# Altium schematic sheet IsoDcDc-BSR033A.SchDoc: LM5180EVM-S05 Buck Converter Schematic
size 431 x 279 mm; Date: Not shown in title block; ApprovedBy: Not shown in title block; CheckedBy: Not shown in title block; Author: Not shown in title block; CompanyName: Not shown in title block; DrawnBy: K Nielson; Engineer: Not shown in title block; Organization: Not shown in title block; Address1: Not shown in title block; Address2: Not shown in title block; Address3: Not shown in title block; Address4: Not shown in title block; DocumentNumber: 1; Revision: Use project parameter SCH_Rev; SheetNumber: 1; SheetTotal: 2; PageSetup: Record=PageOptions|CenterHorizontal=True|CenterVertical=True|PrintScale=1.00|XCorrection=1.00|YCorrection=1.00|PrintKind=0|BorderSize=5000000|LeftOffset=0|BottomOffset=0|Orientation=2|PaperLength=1000|PaperWidth=1000|Scale=100|PaperSource=15|PrintQuality=600|MediaType=1|DitherType=10|PaperKind=Letter|PrintScaleMode=1; CurrentTime: Not shown in title block; CurrentDate: Not shown in title block; Time: Not shown in title block; DocumentFullPathAndName: Not shown in title block; DocumentName: Not shown in title block; ModifiedDate: Not shown in title block; ImagePath: Not shown in title block
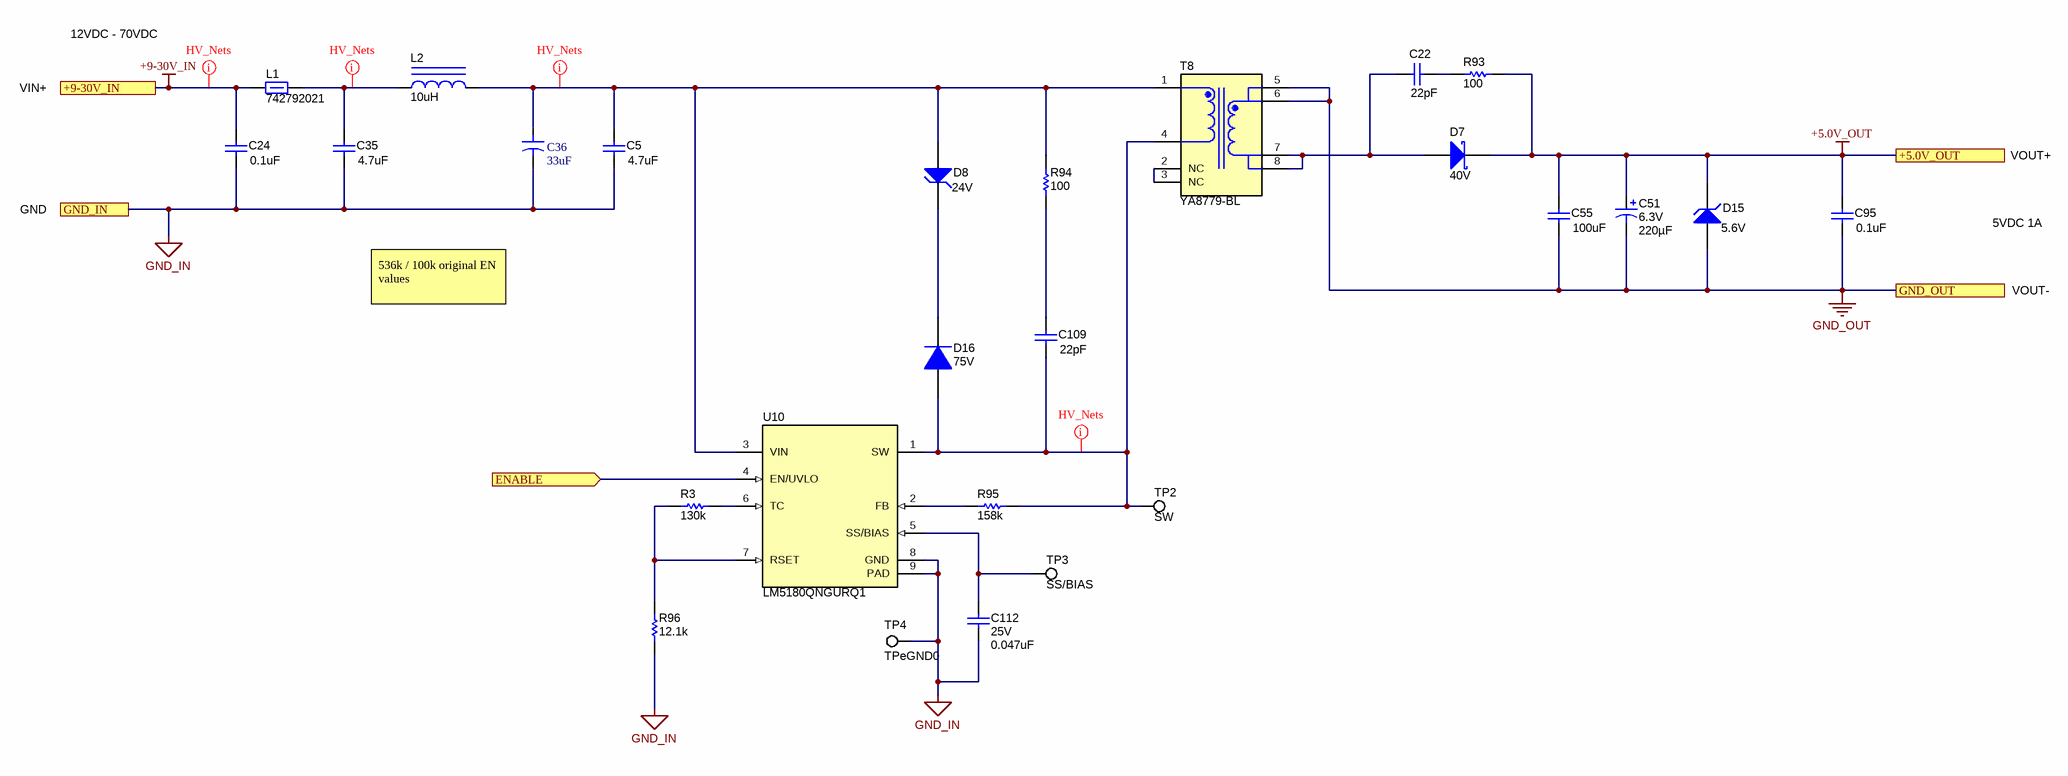
[diagram p0: IsoDcDc-BSR033A.SchDoc]

## Parts
C5  ValueDisplayed: 4.7uF  [1210C]  (hidden comment: GRM32DC72A475KE01L)
C22  ValueDisplayed: 22pF  [0603C]  (hidden comment: GRM1885C2A220JA01D)
C24  ValueDisplayed: 0.1uF  [0603C]  (hidden comment: GRM188R72A104KA35J)
C35  ValueDisplayed: 4.7uF  [1210C]  (hidden comment: GRM32DC72A475KE01L)
C36  value 33uF  [CAPC7343X430M]  (hidden comment: CAP TANTALUM 33UF 50V 2917)
C51  VDC_V: 6.3V  ValueDisplayed: 220µF  [7343-31]  (hidden comment: T598D107M010ATE025)
C55  ValueDisplayed: 100uF  [1210C]  (hidden comment: GRM32EC80J107ME20L)
C95  ValueDisplayed: 0.1uF  [0603C]  (hidden comment: GRM188R72A104KA35J)
C109  ValueDisplayed: 22pF  [0603C]  (hidden comment: GRM1885C2A220JA01D)
C112  VDC_V: 25V  ValueDisplayed: 0.047uF  [0603C]  (hidden comment: GCM188R71E473KA37D)
D7  40V  [SMAF]
D8  Vz_V: 24V  [PowerDI123]  (hidden comment: DFLZ24-7)
D15  Vz_V: 5.6V  [SOD-323]  (hidden comment: MMSZ5232BS-7-F)
D16  75V  [SOD-323]
L1  742792021  [0805_HV]
L2  ValueDisplayed: 10uH  [WE-TPC-M1]  (hidden comment: 744042100)
R3  ValueDisplayed: 130k  [0603R]  (hidden comment: CRCW0603130KFKEA)
R93  ValueDisplayed: 100  [0603R]  (hidden comment: CRCW0603100RFKEA)
R94  ValueDisplayed: 100  [0603R]  (hidden comment: CRCW0603100RFKEA)
R95  ValueDisplayed: 158k  [0603R]  (hidden comment: CRCW0603158KFKEA)
R96  ValueDisplayed: 12.1k  [0603R]  (hidden comment: CRCW060312K1FKEA)
T8  YA8779-BL  [Coilcraft_YA8779-CL]
TP2  SW  [Testpoint_Keystone_Miniature]
TP3  SS/BIAS  [Testpoint_Keystone_Miniature]
TP4  TPeGND0  [Testpoint_Keystone_Miniature]
U10  LM5180QNGURQ1  [NGU0008C]

## Ports
+5.0V_OUT, +9-30V_IN, ENABLE (in), GND_IN, GND_OUT

## Nets
+5.0V_OUT: C51.1(+) C55.1 C95.1 D7.1(K) D15.1(K) R93.1 ; port +5.0V_OUT
+9-30V_IN: C24.1 L1.1 ; port +9-30V_IN
GND_IN: C5.1 C24.2 C35.1 C36.2 C112.2 R96.1 TP4.1 U10.8(GND) U10.9(PAD) ; port GND_IN
GND_OUT: C51.2(-) C55.2 C95.2 D15.2(A) T8.5 T8.6 ; port GND_OUT
ENABLE: U10.4(EN/UVLO) ; port ENABLE
NetC5_2: C5.2 C36.1 D8.2(A) L2.2 R94.2 T8.1 U10.3(VIN)
NetC22_1: C22.1 R93.2
NetC22_2: C22.2 D7.2(A) T8.7 T8.8
NetC35_2: C35.2 L1.2 L2.1
NetC109_1: C109.1 R94.1
NetC109_2: C109.2 D16.2(A) R95.2 T8.4 TP2.1 U10.1(SW)
NetC112_1: C112.1 TP3.1 U10.5(SS/BIAS)
NetD8_1: D8.1(K) D16.1(K)
NetR3_1: R3.1 R96.2 U10.7(RSET)
NetR3_2: R3.2 U10.6(TC)
NetR95_1: R95.1 U10.2(FB)
NetT8_2: T8.2(NC) T8.3(NC)

## Layout directives
net class HV_Nets: +9-30V_IN, NetC5_2, NetC35_2, NetC109_2

## Notes on the sheet
- 12VDC - 70VDC
- VIN+
- GND
- VOUT+
- 5VDC 1A
- 536k / 100k original EN values
- VOUT-
- Drawn By:
- SVN Rev:
- Number:
- TID #:
- Orderable:
- Rev:
- Sheet Title:
- File:
- Project Title:
- Designed for:
- Assembly Variant:
- Mod. Date:
- Sheet:
- Size:
- of
- B
- http://www.ti.com
- Texas Instruments and/or its licensors do not warrant the accuracy or completeness of this specification or any information contained therein. Texas Instruments and/or its licensors do not warrant that this design will meet the specifications, will be suitable for your application or fit for any particular purpose, or will operate in an implementation. Texas Instruments and/or its licensors do not warrant that the design is production worthy. You should completely validate and test your design implementation to confirm the system functionality for your application.
- Engineer:
- Contact:
- © Texas Instruments

## Library data of the parts
C5 C35 = CMP-0009182-2: CAP, CERM, 4.7 uF, 100 V, +/- 10%, X7S, 1210; Manufacturer: MuRata; TaMin_C: -55°C; Polarized: N; SizeAreaWB_mm2: 14.7; Value1: Unknown; U/M: EA; Value: 4.7uF; TaMax_C: 125°C; SizeZ_mm: 2.2; SizeX_mm: 3.2; SizeY_mm: 2.5; Cap_Case: 1210; Value2: 100V; SizeArea_mm2: 8; CompType: Capacitor; Cap_F: 4.7µF; AEC Category: Q200; Publisher: Texas Instruments; TempCo: X7S; Published: 2008-06-19; RoHS: Y; MountType: SMT; Supplier 1: Mouser; PackageReference: 1210; Tolerance_%: 10%; LatestRevisionDate: 2017-03-09; PartNumber: GRM32DC72A475KE01L; AEC Qualified: N; VDC_V: 100V; ComponentLink1Description: Datasheet link; AEC Grade: N/A; Supplier Part Number 1: 81-GRM32DC72A475KE1L; Technology: Ceramic; ComponentLink1URL: http://search.murata.co.jp/Ceramy/image/img/A01X/G101/ENG/GRM32DC72A475KE01-01.pdf
C22 = CMP-0007255-4: CAP, CERM, 22 pF, 100 V, +/- 5%, C0G/NP0, 0603; Manufacturer: MuRata; TaMin_C: -55°C; Polarized: N; SizeAreaWB_mm2: 4.68; U/M: EA; Value: 22pF; TaMax_C: 125°C; SizeZ_mm: 1; SizeX_mm: 1.6; SizeY_mm: 0.8; Cap_Case: 0603; Value2: 100V; SizeArea_mm2: 1.28; CompType: Capacitor; AEC Category: Q200; Value1: Unknown; ComponentLink1URL: http://search.murata.co.jp/Ceramy/PnsearchViewAction.do?HnOFG=ON&HnNFG=ON&SEL_CNT=50&sLang=en&sKey=GRM1885C2A220JA01D&x=9&y=9&search=startwith; Supplier Part Number 2: 81-GRM1885C2A220JA01; Supplier 2: Mouser; TempCo: C0G/NP0; RoHS: Y; MountType: SMT; Supplier 1: Digi-Key; PackageReference: 0603; Tolerance_%: 5%; PartNumber: GRM1885C2A220JA01D; AEC Qualified: ?; Cap_F: 22pF; VDC_V: 100V; ComponentLink1Description: Datasheet link; Supplier Part Number 1: 490-1335-1-ND; Technology: Ceramic; Publisher: Texas Instruments; Published: 2008-06-19; LatestRevisionDate: 2017-03-09
C24 C95 = CMP-0007470-5: CAP, CERM, 0.1 uF, 100 V, +/- 10%, X7R, 0603; Manufacturer: MuRata; TaMin_C: -55°C; Polarized: N; SizeAreaWB_mm2: 4.68; Value1: Unknown; U/M: EA; Value: 0.1uF; TaMax_C: 125°C; SizeZ_mm: 1; SizeX_mm: 1.6; SizeY_mm: 0.8; Cap_Case: 0603; Value2: 100V; SizeArea_mm2: 1.28; CompType: Capacitor; Cap_F: 100nF; AEC Category: Q200; Supplier Part Number 2: 81-GRM188R72A104KA5J; Publisher: Texas Instruments; Supplier 2: Mouser; TempCo: X7R; Published: 2008-06-19; RoHS: Y; MountType: SMT; Supplier 1: Digi-Key; PackageReference: 0603; Tolerance_%: 10%; LatestRevisionDate: 2017-03-09; PartNumber: GRM188R72A104KA35J; AEC Qualified: ?; VDC_V: 100V; ComponentLink1Description: Datasheet link; Supplier Part Number 1: 490-6439-1-ND; Technology: Ceramic; ComponentLink1URL: http://search.murata.co.jp/Ceramy/image/img/A01X/G101/ENG/GRM188R72A104KA35-01.pdf
C36 = T521X336M050ATE075: 33µF Molded Tantalum Polymer Capacitor 50V 2917 (7343 Metric) 75mOhm @ 100kHz; Supplier 1: Digi-Key; Supplier Part Number 1: 399-11721-1-ND
C51 = CMP-0074683-2: CAP, Aluminum Polymer, 220 µF, 6.3 V,+/- 20%, 0.01 ohm, 7343-31 SMD; Manufacturer: MuRata; PartNumber: ECASD60J227M010K00; TaMin_C: -40°C; ESR_ohm: 0.01; Polarized: Y; SizeAreaWB_mm2: 58.59; Value: 220uF; TaMax_C: 105°C; SizeZ_mm: 3.1; SizeX_mm: 7.3; SizeY_mm: 4.3; SizeArea_mm2: 31.39; CompType: Capacitor; AEC Qualified: N; IRMS_A: 3A; AEC Category: Q200; ComponentLink1URL: http://www.murata.com/~/media/webrenewal/support/library/catalog/products/capacitor/polymer/c90e.ashx; Supplier Part Number 2: 11AC3033; Supplier 2: Newark; Supplier Part Number 3: 81-ECASD60J227M010K0; Supplier 3: Mouser; RoHS: Y; Value1: 0.01 ohm; MountType: SMT; Supplier 1: Digi-Key; PackageReference: 7343-31; Tolerance_%: 20%; Cap_Case: 7343-31; Value2: 6.3V; Series: ECAS; Cap_F: 220µF; ComponentLink1Description: Datasheet link; AEC Grade: N/A; Supplier Part Number 1: 490-12529-1-ND; Technology: Aluminum Polymer
C55 = CMP-0009199-2: CAP, CERM, 100 uF, 6.3 V, +/- 20%, X6S, 1210; Manufacturer: MuRata; TaMin_C: -55°C; Polarized: N; SizeAreaWB_mm2: 14.7; Value1: Unknown; U/M: EA; Value: 100uF; TaMax_C: 105°C; SizeZ_mm: 2.7; SizeX_mm: 3.2; SizeY_mm: 2.5; Cap_Case: 1210; Value2: 6.3V; SizeArea_mm2: 8; Cap_F: 100µF; AEC Category: Q200; Supplier Part Number 2: 81-GRM32EC80J107ME0L; Publisher: Texas Instruments; Supplier 2: Mouser; Supplier Part Number 3: 1889302; TempCo: X6S; Supplier 3: Farnell; Published: 2008-06-19; RoHS: Y; MountType: SMT; Supplier 1: Digi-Key; PackageReference: 1210; Tolerance_%: 20%; CompType: Capacitor; LatestRevisionDate: 2017-03-09; PartNumber: GRM32EC80J107ME20L; AEC Qualified: ?; VDC_V: 6.3V; ComponentLink1Description: Datasheet link; Supplier Part Number 1: GRM32EC80J107ME20L-ND; Technology: Ceramic; ComponentLink1URL: http://search.murata.co.jp/Ceramy/PnsearchViewAction.do?HnOFG=ON&HnNFG=ON&SEL_CNT=50&sLang=en&sKey=GRM32EC80J107ME20L&x=9&y=9&search=startwith
C109 = CMP-0007255-4: CAP, CERM, 22 pF, 100 V, +/- 5%, C0G/NP0, 0603; Manufacturer: MuRata; TaMin_C: -55°C; Polarized: N; SizeAreaWB_mm2: 4.68; Value1: Unknown; U/M: EA; Value: 22pF; TaMax_C: 125°C; SizeZ_mm: 1; SizeX_mm: 1.6; SizeY_mm: 0.8; Cap_Case: 0603; Value2: 100V; SizeArea_mm2: 1.28; CompType: Capacitor; AEC Category: Q200; Supplier Part Number 2: 81-GRM1885C2A220JA01; Supplier 2: Mouser; TempCo: C0G/NP0; RoHS: Y; MountType: SMT; Supplier 1: Digi-Key; PackageReference: 0603; Tolerance_%: 5%; PartNumber: GRM1885C2A220JA01D; AEC Qualified: ?; Cap_F: 22pF; VDC_V: 100V; ComponentLink1Description: Datasheet link; Supplier Part Number 1: 490-1335-1-ND; Technology: Ceramic; ComponentLink1URL: http://search.murata.co.jp/Ceramy/PnsearchViewAction.do?HnOFG=ON&HnNFG=ON&SEL_CNT=50&sLang=en&sKey=GRM1885C2A220JA01D&x=9&y=9&search=startwith; Publisher: Texas Instruments; Published: 2008-06-19; LatestRevisionDate: 2017-03-09
C112 = CMP-0007141-5: CAP, CERM, 0.047 uF, 25 V, +/- 10%, X7R, AEC-Q200 Grade 1, 0603; Manufacturer: MuRata; TaMin_C: -55°C; Polarized: N; SizeAreaWB_mm2: 4.68; Value1: Unknown; U/M: EA; TaMax_C: 125°C; SizeZ_mm: 1; SizeX_mm: 1.6; SizeY_mm: 0.8; Cap_Case: 0603; SizeArea_mm2: 1.28; CompType: Capacitor; AEC Qualified: Y; Cap_F: 47nF; AEC Category: Q200; Supplier Part Number 2: 81-GCM188R71E473KA7D; Publisher: Texas Instruments; Supplier 2: Mouser; TempCo: X7R; Published: 2008-06-19; RoHS: Y; MountType: SMT; Value: 0.047uF; Supplier 1: Digi-Key; PackageReference: 0603; Tolerance_%: 10%; Value2: 25V; LatestRevisionDate: 2017-03-09; PartNumber: GCM188R71E473KA37D; ComponentLink1Description: Datasheet link; Supplier Part Number 1: 490-8018-1-ND; Technology: Ceramic; ComponentLink1URL: http://psearch.murata.com/capacitor/product/GCM188R71E473KA37%23.pdf; AEC Grade: 1
D7 = CMP-0028855-1: Diode, Schottky, 40 V, 3 A, AEC-Q101, SMAF; PartNumber: FSV340AF; Manufacturer: Fairchild Semiconductor; SizeAreaWB_mm2: 19.95; SizeArea_mm2: 11.75; AEC Qualified: Y; TJmax_C: 150°C; AEC Category: Q101; SizeZ_mm: 1; Green_REACh: Incomplete; Io_A: 3A; Vf_V: 5dV; SizeY_mm: 2.5; Value2: 0.5V; Green_Lifecycle: Not Set; U/M: EA; SizeX_mm: 4.7; ComponentLink1Description: Datasheet link; RoHS: Y; Supplier 1: Digi-Key; Vr_V: 40V; Green_EU RoHS: Incomplete; PackageReference: SMAF; Value: 40V; Publisher: Texas Instruments; Supplier Part Number 2: 512-FSV340AF; Supplier 2: Mouser; Published: 2008-06-26; LatestRevisionDate: 2017-05-08; ComponentLink1URL: https://www.fairchildsemi.com/datasheets/FS/FSV330AF.pdf; Value1: 3A; CompType: Diode; MountType: SMT; Supplier Part Number 1: FSV340AFCT-ND; Type: Schottky; Green_EU RoHS-2: Incomplete
D8 = CMP-0005415-2: Diode, Zener, 24 V, 1 W, PowerDI123; Manufacturer: Diodes Inc.; Power_W: 1W; SizeAreaWB_mm2: 13.066; RJA_CperW: 110; U/M: EA; Value: 24V; SizeZ_mm: 0.98; SizeX_mm: 3.7; SizeY_mm: 1.78; SizeArea_mm2: 6.586; AEC Category: Q101; Supplier Part Number 2: 621-DFLZ24-7; Publisher: Texas Instruments; Supplier 2: Mouser; Supplier Part Number 3: 2077975; Supplier 3: Farnell; Published: 2008-10-08; RoHS: Y; Value1: 1W; MountType: SMT; Supplier 1: Digi-Key; LatestRevisionNote: Updated Supplier Data; PackageReference: PowerDI123; CompType: Zener; LatestRevisionDate: 2017-03-09; PartNumber: DFLZ24-7; AEC Qualified: ?; ComponentLink1Description: Datasheet link; Supplier Part Number 1: DFLZ24DICT-ND; ComponentLink1URL: http://www.diodes.com/datasheets/ds30464.pdf
D15 = CMP-0005855-1: Diode, Zener, 5.6 V, 200 mW, SOD-323; Manufacturer: Diodes Inc.; Power_W: 200mW; SizeAreaWB_mm2: 8.695; Value1: 0.2W; RJA_CperW: 350; U/M: EA; Value: 5.6V; SizeZ_mm: 1; SizeX_mm: 2.7; SizeY_mm: 1.35; SizeArea_mm2: 3.645; AEC Category: Q101; ComponentLink1URL: http://www.diodes.com/datasheets/ds31038.pdf; Supplier Part Number 2: 621-MMSZ5232BS-F; Publisher: Texas Instruments; Supplier 2: Mouser; Published: 2008-10-08; RoHS: Y; MountType: SMT; Supplier 1: Digi-Key; LatestRevisionNote: Updated Supplier Data; PackageReference: SOD-323; CompType: Zener; LatestRevisionDate: 2017-03-09; PartNumber: MMSZ5232BS-7-F; AEC Qualified: ?; ComponentLink1Description: Datasheet link; Supplier Part Number 1: MMSZ5232BS-FDICT-ND
D16 = CMP-0029019-1: Diode, Ultrafast, 75 V, 0.25 A, SOD-323; Manufacturer: Central Semiconductor; PartNumber: CMDD4448; Io_A: 2.5dA; Green_Lifecycle: Not Set; SizeAreaWB_mm2: 8.695; Green_REACh: Incomplete; Value1: 0.25A; TJmax_C: 175°C; U/M: EA; SizeZ_mm: 1; SizeX_mm: 2.7; SizeY_mm: 1.35; Vf_V: 1.2V; SizeArea_mm2: 3.645; AEC Category: Q101; ComponentLink1URL: http://www.centralsemi.com/PDFs/products/CMDD4448.PDF; Publisher: Texas Instruments; Vr_V: 75V; Published: 2008-06-26; RoHS: Y; MountType: SMT; Green_EU RoHS-2: Incomplete; Value: 75V; Green_EU RoHS: Incomplete; PackageReference: SOD-323; Value2: 1.2V; CompType: Diode; Type: Ultrafast; LatestRevisionDate: 2017-05-08; AEC Qualified: ?; ComponentLink1Description: Datasheet link
L1 = CMP-0003072-1: Ferrite Bead, 22 ohm @ 100 MHz, 6 A, 0805; Manufacturer: Wurth Elektronik; Ztyp@1GHz_Ohm: 40.219; ZTyp@100MHz_Ohm: 22; SizeAreaWB_mm2: 6.75; DCR_ohm: 8m; Value1: 0.008 ohm; Value: 22 ohm; Imax_A: 6A; SizeZ_mm: 1.45; SizeX_mm: 2; SizeY_mm: 1.25; SizeArea_mm2: 2.5; ComponentLink1URL: http://katalog.we-online.de/pbs/datasheet/742792021.pdf; Supplier Part Number 2: 710-742792021; Publisher: Texas Instruments; Supplier 2: Mouser; Published: 2014-04-30; RoHS: Y; MountType: SMT; Supplier 1: Digi-Key; PackageReference: 0805; Value2: 6A; CompType: Ferrite Bead; LatestRevisionDate: 2017-03-09; PartNumber: 742792021; ComponentLink1Description: Datasheet link; Supplier Part Number 1: 732-4637-1-ND; ValueDisplayed: 22 ohm
L2 = CMP-0063804-1: Inductor, Shielded Drum Core, Ferrite, 10 uH, 1 A, 0.12 ohm, SMD; Manufacturer: Wurth Elektronik; Isat: 1A @ 35% inductance drop; Irms: 1.3A @ 30C rise; Green_Lifecycle: Active; SizeAreaWB_mm2: 33.64; DCR_ohm: 1.2d; Green_REACh: Passed; Value: 10uH; Imax_A: 1A; SizeZ_mm: 1.8; SizeX_mm: 4.8; SizeArea_mm2: 23.04; Ind_H: 10µH; AEC Category: Q200; PackageReference: WE-TPC-M1; ComponentLink1Description: Datasheet link; ComponentLink1URL: http://www.we-online.com/eisos/pdf/744042100.pdf; Supplier Part Number 2: 710-744042100; Publisher: Texas Instruments; Supplier 2: Mouser; Supplier Part Number 3: 1635842; Supplier 3: Farnell; Published: 2008-06-26; RoHS: Y; Value1: 0.12 ohm; Material: Ferrite; MountType: SMT; Green_EU RoHS-2: Incomplete; Supplier 1: Digi-Key; Green_EU RoHS: Passed; SizeY_mm: 4.8; Value2: 1A; CompType: Inductor; LatestRevisionDate: 2017-06-02; PartNumber: 744042100; AEC Qualified: ?; Supplier Part Number 1: 732-1025-1-ND; Technology: Shielded Drum Core
R3 = CMP-0022036-4: RES, 130 k, 1%, 0.1 W, AEC-Q200 Grade 0, 0603; Manufacturer: Vishay-Dale; Power_W: 100mW; TempCo: 100 ppm/C; Value: 130k; EIA_Code: E96; SizeX_mm: 1.6; SizeY_mm: 0.8; SizeZ_mm: 1; Value2: 0.1W; SizeArea_mm2: 1.28; CompType: Resistor; AEC Qualified: Y; VDC_V: 75V; AEC Category: Q200; AEC Grade: 0; Supplier Part Number 2: 52K8127; Supplier 2: Newark; Supplier Part Number 3: 71-CRCW0603-130K-E3; Supplier 3: Mouser; Value_Code: 130k; RoHS: E; Value1: 1%; MountType: SMT; Supplier 1: Digi-Key; PackageReference: 0603; Tolerance_%: 1%; Res_ohm: 130k; PartNumber: CRCW0603130KFKEA; ComponentLink1Description: Datasheet link; Supplier Part Number 1: 541-130KHCT-ND; Technology: Thick Film; ComponentLink1URL: http://www.vishay.com/docs/20035/dcrcwe3.pdf
R93 R94 = CMP-0021991-3: RES, 100, 1%, 0.1 W, 0603; Manufacturer: Vishay-Dale; Power_W: 100mW; TempCo: 100 ppm/C; Value_Code: 100R; U/M: EA; Value: 100; EIA_Code: E96; SizeX_mm: 1.6; SizeY_mm: 0.8; SizeZ_mm: 1; Value2: 0.1W; SizeArea_mm2: 1.28; CompType: Resistor; VDC_V: 75V; AEC Category: Q200; Supplier Part Number 2: 52K8078; Publisher: Texas Instruments; Supplier 2: Newark; Supplier Part Number 3: 71-CRCW0603-100-E3; Supplier 3: Mouser; Published: 2008-06-26; RoHS: Y; Value1: 1%; MountType: SMT; Supplier 1: Digi-Key; PackageReference: 0603; Tolerance_%: 1%; Res_ohm: 100; LatestRevisionDate: 2017-03-09; PartNumber: CRCW0603100RFKEA; AEC Qualified: ?; ComponentLink1Description: Datasheet link; Supplier Part Number 1: 541-100HCT-ND; Technology: Thick Film; ComponentLink1URL: http://www.vishay.com/docs/20035/dcrcwe3.pdf
R95 = CMP-0022064-4: RES, 158 k, 1%, 0.1 W, AEC-Q200 Grade 0, 0603; Manufacturer: Vishay-Dale; Power_W: 100mW; TempCo: 100 ppm/C; Value: 158k; EIA_Code: E96; SizeX_mm: 1.6; SizeY_mm: 0.8; SizeZ_mm: 1; Value2: 0.1W; SizeArea_mm2: 1.28; CompType: Resistor; AEC Qualified: Y; VDC_V: 75V; AEC Category: Q200; AEC Grade: 0; ComponentLink1URL: http://www.vishay.com/docs/20035/dcrcwe3.pdf; Supplier Part Number 2: 52K8164; Supplier 2: Newark; Supplier Part Number 3: 71-CRCW0603-158K-E3; Supplier 3: Mouser; Value_Code: 158k; RoHS: E; Value1: 1%; MountType: SMT; Supplier 1: Digi-Key; PackageReference: 0603; Tolerance_%: 1%; Res_ohm: 158k; PartNumber: CRCW0603158KFKEA; ComponentLink1Description: Datasheet link; Supplier Part Number 1: 541-158KHCT-ND; Technology: Thick Film
R96 = CMP-0022030-3: RES, 12.1 k, 1%, 0.1 W, 0603; Manufacturer: Vishay-Dale; Power_W: 100mW; TempCo: 100 ppm/C; Value_Code: 12k1; U/M: EA; Value: 12.1k; EIA_Code: E96; SizeX_mm: 1.6; SizeY_mm: 0.8; SizeZ_mm: 1; Value2: 0.1W; SizeArea_mm2: 1.28; CompType: Resistor; VDC_V: 75V; AEC Category: Q200; Supplier Part Number 2: 52K8105; Publisher: Texas Instruments; Supplier 2: Newark; Supplier Part Number 3: 71-CRCW0603-12.1K-E3; Supplier 3: Mouser; Published: 2008-06-26; RoHS: Y; Value1: 1%; MountType: SMT; Supplier 1: Digi-Key; PackageReference: 0603; Tolerance_%: 1%; LatestRevisionDate: 2017-03-09; PartNumber: CRCW060312K1FKEA; AEC Qualified: ?; ComponentLink1Description: Datasheet link; Supplier Part Number 1: 541-12.1KHCT-ND; Technology: Thick Film; Res_ohm: 12.1k; ComponentLink1URL: http://www.vishay.com/docs/20035/dcrcwe3.pdf
T8 = CMP-0085524-1: Transformer, 30 uH, SMD; Manufacturer: Coilcraft; SizeAreaWB_mm2: 137.86; SizeArea_mm2: 94.86; AEC Qualified: N; Lp: 30; AEC Category: Q200; Value: 30uH; SizeZ_mm: 10.6; Ind_H: 30µH; SizeY_mm: 10.2; Ns1toNp: 0.33; Rsec1_ohm: 0.025; DCR_ohm: 0.014; SizeX_mm: 9.3; LeakageInd_H: 380nH; ComponentLink1Description: Datasheet URL; RoHS: Y; PackageReference: 9.3x10.2mm; PartNumber: YA8779-BL; AEC Grade: N/A; ComponentLink1URL: https://sps16.itg.ti.com/sites/KMS/crossdivteams/altium/docs/ComponentDatasheets/YA8779-BL -- 5V single output.pdf; CompType: Transformer; MountType: SMT; ValueDisplayed: 30µH; Ns2toNp: 0.33; Rsec2_ohm: 0.025
TP2-TP4 = CMP-0055152-1: Test Point, Miniature, SMT; Manufacturer: Keystone; PartNumber: 5015; CNHeader: FALSE; Green_Lifecycle: Active; Green_REACh: Passed; CT: TRUE; ComponentLink1URL: http://www.keyelco.com/userAssets/store/files/5015.PDF; Supplier Part Number 2: 534-5015; Publisher: Texas Instruments; Supplier 2: Mouser; RoHS: Y; MountType: SMT; Green_EU RoHS-2: Incomplete; Supplier 1: Digi-Key; Green_EU RoHS: Passed; PackageReference: Testpoint_Keystone_Miniature; CompType: Test Point; LatestRevisionDate: 26/05/2017; ComponentLink1Description: Datasheet URL; Supplier Part Number 1: 36-5015TR-ND
U10 = CMP-0078633-2: 70-V PSR Flyback Converter With 100-V, 1.2-A Power Switch and Ultra-Low IQ, NGU0008C (WSON-8); Alternate PartNumber: LM5180QNGUTQ1; Alternate Manufacturer: Texas Instruments; Alternate Manufacturer: None; SizeAreaWB_mm2: 25; SizeZ_mm: 0.8; SizeX_mm: 4; SizeArea_mm2: 16; CompType: IC; AEC Qualified: Y; AEC Category: Q200; ComponentLink1URL: http://www.ti.com/lit/ds/symlink/lm5180-q1.pdf; PackageDescription: WSON-8; MountType: SMT; ComponentLink2URL: http://www.ti.com/product/lm5180-q1; ComponentLink2Description: Product Folder; Manufacturer: Texas Instruments; PackageReference: NGU0008C; SizeY_mm: 4; PartNumber: LM5180QNGURQ1; ComponentLink1Description: Datasheet Link